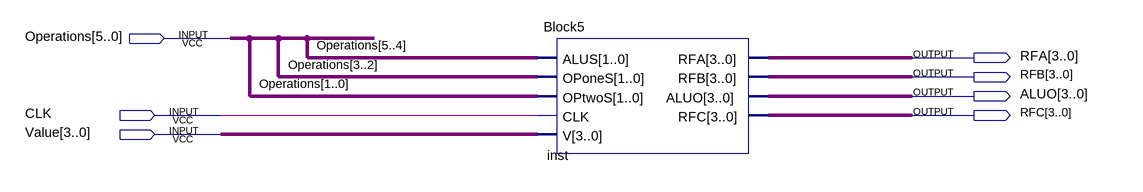
[diagram p0: schematic sheet]
// Quartus schematic FinalBlock.bdf as structural Verilog: 1 symbols, 7 pins
module FinalBlock (
  input  [5:0] Operations,
  input  CLK,
  input  [3:0] Value,
  output [3:0] RFA,
  output [3:0] RFB,
  output [3:0] ALUO,
  output [3:0] RFC
);

  Block5 inst (
    .ALUS(Operations[5:4]), .OPoneS(Operations[3:2]), .OPtwoS(Operations[1:0]), .CLK(CLK), .V(Value),
    .RFA(RFA), .RFB(RFB), .ALUO(ALUO), .RFC(RFC));
endmodule
